# EAGLE design schematic (EAGLE 9.4.1)
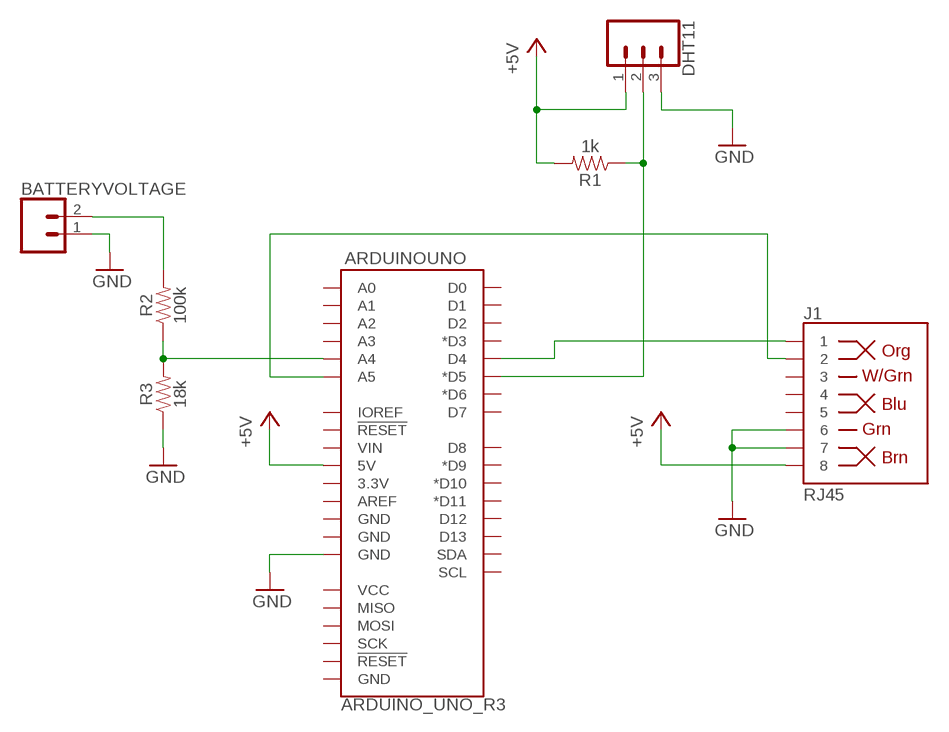
[diagram p0: schematic, sheet 1]

## Parts
ARDUINOUNO  ARDUINO_UNO_R3  [ARDUINO_R3]
BATTERYVOLTAGE  CONN_02  [1X02]
DHT11  CONN_03  [1X03]
J1  RJ45  RJ45-8  [RJ45-8]
R1  1k  1KOHM-HORIZ-1/4W-1%  [AXIAL-0.3]
R2  100k  1KOHM-HORIZ-1/4W-1%  [AXIAL-0.3]
R3  18k  1KOHM-HORIZ-1/4W-1%  [AXIAL-0.3]

## Nets
+5V: ARDUINOUNO.5V DHT11.1 J1.8 R1.P$2
GND: ARDUINOUNO.GND@2(GND) BATTERYVOLTAGE.1 DHT11.3 J1.6 J1.7 R3.P$1
N$1: ARDUINOUNO.D4 J1.1
N$2: ARDUINOUNO.A5 J1.2
N$3: ARDUINOUNO.A4 R2.P$1 R3.P$2
N$4: BATTERYVOLTAGE.2 R2.P$2
N$7: ARDUINOUNO.D5(*D5) DHT11.2 R1.P$1
Unconnected: ARDUINOUNO.3.3V ARDUINOUNO.A0 ARDUINOUNO.A1 ARDUINOUNO.A2 ARDUINOUNO.A3 ARDUINOUNO.AREF ARDUINOUNO.D0 ARDUINOUNO.D1 ARDUINOUNO.D2 ARDUINOUNO.D3(*D3) ARDUINOUNO.D6(*D6) ARDUINOUNO.D7 ARDUINOUNO.D8 ARDUINOUNO.D9(*D9) ARDUINOUNO.D10(*D10) ARDUINOUNO.D11(*D11) ARDUINOUNO.D12 ARDUINOUNO.D13 ARDUINOUNO.GND@1(GND) ARDUINOUNO.GND@3(GND) ARDUINOUNO.GND@4(GND) ARDUINOUNO.IOREF ARDUINOUNO.MISO ARDUINOUNO.MOSI ARDUINOUNO.RESET@1(!RESET!) ARDUINOUNO.RESET@2(!RESET!) ARDUINOUNO.SCK ARDUINOUNO.SCL ARDUINOUNO.SDA ARDUINOUNO.VCC ARDUINOUNO.VIN J1.3 J1.4 J1.5

## Library data of the parts
ARDUINOUNO = SparkFun-Boards:ARDUINO_UNO_R3: Arduino R3 Footprint with SPI header Arduino Uno R3 Compatible Footprint. Matches PCB size of the original board. SparkFun Products: SAMD21 Dev Breakout <https://www.sparkfun.com/products/13672> RedBoard <https://www.sparkfun.com/products/12757> R3 Stackable Headers <https://www.sparkfun.com/products/11417>
BATTERYVOLTAGE = SparkFun-Connectors:CONN_02: Multi connection point. Often used as Generic Header-pin footprint for 0.1 inch spaced/style header connections On any of the 0.1 inch spaced packages, you can populate with these: Break Away Headers - Straight <https://www.sparkfun.com/products/116> (PRT-00116) Break Away Male Headers - Right Angle <https://www.sparkfun.com/products/553> (PRT-00553) Female Headers <https://www.sparkfun.com/products/115> (PRT-00115) Break Away Headers - Machine Pin <https://www.sparkfun.com/products/117> (PRT-00117) Break Away Female Headers - Swiss Machine Pin <https://www.sparkfun.com/products/743> (PRT-00743) For SCREWTERMINALS and SPRING TERMINALS visit here: Screw Terimnals on SparkFun.com <https://www.sparkfun.com/search/results?term=Screw+Terminals> (5mm/3.5mm/2.54mm spacing) This device is also useful as a general connection point to wire up your design to another part of your project. Our various solder wires solder well into these plated through hole pads. Hook-Up Wire - Assortment (Stranded, 22 AWG) <https://www.sparkfun.com/products/11375> (PRT-11375) Hook-Up Wire - Assortment (Solid Core, 22 AWG) <https://www.sparkfun.com/products/11367> (PRT-11367) View the entire wire category on our website here <https://www.sparkfun.com/categories/141> Special notes: Molex polarized connector foot print use with: PRT-08233 with associated crimp pins and housings. 2.54_SCREWTERM for use with PRT-10571. 3.5mm Screw Terminal footprints for PRT-08084 5mm Screw Terminal footprints for use with PRT-08432
DHT11 = SparkFun-Connectors:CONN_03: Multi connection point. Often used as Generic Header-pin footprint for 0.1 inch spaced/style header connections On any of the 0.1 inch spaced packages, you can populate with these: Break Away Headers - Straight <https://www.sparkfun.com/products/116> (PRT-00116) Break Away Male Headers - Right Angle <https://www.sparkfun.com/products/553> (PRT-00553) Female Headers <https://www.sparkfun.com/products/115> (PRT-00115) Break Away Headers - Machine Pin <https://www.sparkfun.com/products/117> (PRT-00117) Break Away Female Headers - Swiss Machine Pin <https://www.sparkfun.com/products/743> (PRT-00743) Stackable Header - 3 Pin (Female, 0.1") <https://www.sparkfun.com/products/13875> (PRT-13875) For SCREWTERMINALS and SPRING TERMINALS visit here: Screw Terimnals on SparkFun.com <https://www.sparkfun.com/search/results?term=Screw+Terminals> (5mm/3.5mm/2.54mm spacing) This device is also useful as a general connection point to wire up your design to another part of your project. Our various solder wires solder well into these plated through hole pads. Hook-Up Wire - Assortment (Stranded, 22 AWG) <https://www.sparkfun.com/products/11375> (PRT-11375) Hook-Up Wire - Assortment (Solid Core, 22 AWG) <https://www.sparkfun.com/products/11367> (PRT-11367) View the entire wire category on our website here <https://www.sparkfun.com/categories/141> Special notes: Molex polarized connector foot print use with SKU : PRT-08232 with associated crimp pins and housings.
J1 = SparkFun-Connectors:RJ45-8: RJ45 Jack - 8 pin Simple RJ45, 8-pin connection. Commonly used for Cat5, Cat5e, and Cat6 Ethernet cables. Here is the connector we sell at SparkFun: RJ45 8-Pin Connector <https://www.sparkfun.com/products/643> (PRT-00643) Datasheet <https://cdn.sparkfun.com/datasheets/Prototyping/04908.pdf> It is used on this SparkFun product: SparkFun RJ45 Breakout <https://www.sparkfun.com/products/716> (BOB-00716) Note, you may also be interested in the "MAGJACK" version of this. It is basically a RJ45 connector, but also has some status LEDs built into the connector housing. You can check that out in this library at the device named "MAGJACK.dev" and see these products online: RJ45 Ethernet MagJack-Compatible <https://www.sparkfun.com/products/8534> (PRT-08534) SparkFun RJ45 MagJack Breakout <https://www.sparkfun.com/products/13021> (BOB-13021); PROD_ID: CONN-08506; SF_ID: PRT-00643
R1 = SparkFun-Resistors:1KOHM: 1kΩ resistor A resistor is a passive two-terminal electrical component that implements electrical resistance as a circuit element. Resistors act to reduce current flow, and, at the same time, act to lower voltage levels within circuits. - Wikipedia; PROD_ID: RES-12182
R2 R3 = SparkFun-Resistors:1KOHM: 1kΩ resistor A resistor is a passive two-terminal electrical component that implements electrical resistance as a circuit element. Resistors act to reduce current flow, and, at the same time, act to lower voltage levels within circuits. - Wikipedia; PROD_ID: RES-12182; VALUE: 1k

## Board
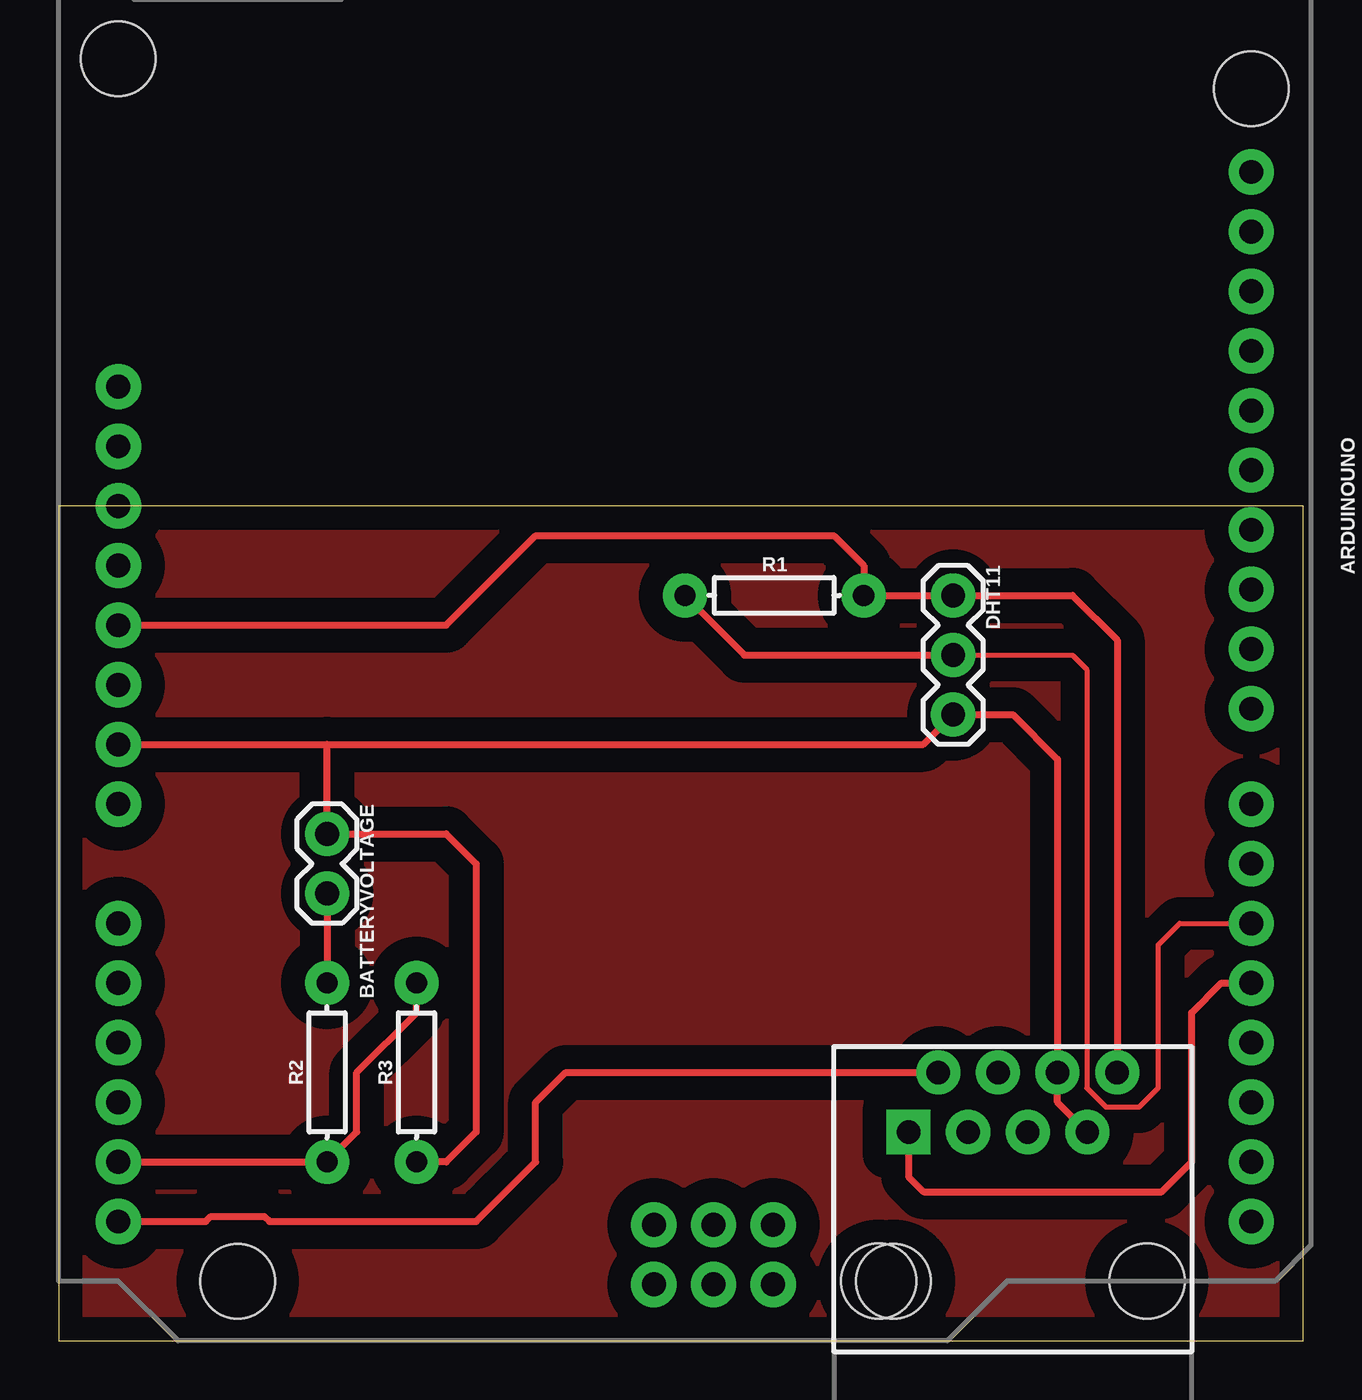
[diagram p1: board, top side]

Size 53.01 x 35.55 mm. Coordinates in mm from the lower left corner, seen from the top.
Outline: 0,0 53.01,0 53.01,35.55 0,35.55 0,0
Copper layers (1*16): Top 0.035mm / dielectric 1.5mm / Bottom 0.035mm
Design rules "default": minimum track width 6mil, minimum drill 0.35mm, track to track 6mil, track to pad 6mil, pad to pad 6mil, via to via 6mil, smd to smd 6mil, copper to edge 40mil, drill to drill 6mil, minimum pad ring 10mil, minimum via ring 8mil, stop-mask expansion 4mil, vias tented up to drill 0mil, thermal gap 10mil

### Footprints (pad centres in the part's own frame; a part is rotated, then mirrored left to right if it is on the bottom)
ARDUINO_R3 = drill 1.016 pad 1.93: 3.3V 2.54,-24.13; 5V 5.08,-24.13; A0 17.78,-24.13; A1 20.32,-24.13; A2 22.86,-24.13; A3 25.4,-24.13; A4 27.94,-24.13; A5 30.48,-24.13; AREF -9.144,24.13; D0 30.48,24.13; D1 27.94,24.13; D2 25.4,24.13; D3 22.86,24.13; D4 20.32,24.13; D5 17.78,24.13; D6 15.24,24.13; D7 12.7,24.13; D8 8.636,24.13; D9 6.096,24.13; D10 3.556,24.13; D11 1.016,24.13; D12 -1.524,24.13; D13 -4.064,24.13; GND@1 7.62,-24.13; GND@2 10.16,-24.13; GND@3 -6.604,24.13; GND@4 33.16,-1.32; IOREF -2.54,-24.13; MISO 30.62,3.76; MOSI 33.16,1.22; NC -5.08,-24.13; RESET@1 0,-24.13; RESET@2 30.62,-1.32; SCK 30.62,1.22; SCL -14.224,24.13; SDA -11.684,24.13; VCC 33.16,3.76; VIN 12.7,-24.13 | hole 3.175: -17.78,24.13; 33.02,8.89; 33.02,-19.05; -19.05,-24.13
1X02 = drill 1.016 pad 1.88: 1 0,0; 2 2.54,0
1X03 = drill 1.016 pad 1.88: 1 0,0; 2 2.54,0; 3 5.08,0
RJ45-8 = drill 1 pad 1.88 square: 1 -4.445,6.35 | drill 1 pad 1.88: 2 -3.175,8.89; 3 -1.905,6.35; 4 -0.635,8.89; 5 0.635,6.35; 6 1.905,8.89; 7 3.175,6.35; 8 4.445,8.89 | hole 3.2: -5.715,0; 5.715,0
AXIAL-0.3 = drill 0.9 pad 1.88: P$1 -3.81,0; P$2 3.81,0

### Placement (x,y rotation side)
ARDUINOUNO  26.67,35.56 270 top
BATTERYVOLTAGE  11.43,21.59 270 top
DHT11  38.1,31.75 270 top
J1  40.64,2.54 0 top
R1  30.48,31.75 0 top
R2  11.43,11.43 90 top
R3  15.24,11.43 90 top

### Tracks (layer width: path | path; a pad name or v marks a point on that pad's centre or on a via)
+5V
  Top 0.305: ARDUINOUNO.5V 16.51,30.48 20.32,34.29 33.02,34.29 34.29,33.02 R1.P$2 DHT11.1 43.18,31.75 45.08,29.84 J1.8
GND
  Top 0.305: R3.P$1 16.51,7.62 17.78,8.89 17.78,20.32 16.51,21.59 BATTERYVOLTAGE.1 11.43,25.4 | ARDUINOUNO.GND@2 11.43,25.4 | 11.43,25.4 36.83,25.4 DHT11.3 40.64,26.67 42.55,24.77 J1.6 42.55,10.16 J1.7
N$1
  Top 0.305: J1.1 36.2,6.98 36.83,6.35 46.99,6.35 48.26,7.62 48.26,13.97 49.53,15.24 ARDUINOUNO.D4
N$2
  Top 0.305: ARDUINOUNO.A5 6.26,5.08 6.48,5.3 8.76,5.3 8.98,5.08 17.78,5.08 20.32,7.62 20.32,10.16 21.59,11.43 J1.2
N$3
  Top 0.305: R3.P$2 15.24,13.97 12.7,11.43 12.7,8.89 R2.P$1 ARDUINOUNO.A4
N$4
  Top 0.305: BATTERYVOLTAGE.2 R2.P$2
N$7
  Top 0.203: DHT11.2 43.18,29.21 43.79,28.6 43.79,10.77 44.6,9.96 46.03,9.96 46.84,10.77 46.84,16.87 47.75,17.78 ARDUINOUNO.D5
  Top 0.305: R1.P$1 29.21,29.21 DHT11.2
NEW
  pour Top (isolate 1.016): 0,35.56 53.34,35.56 53.34,0 0,0